# EAGLE design RainGaugeDropinPhoton (EAGLE 9.0.1)
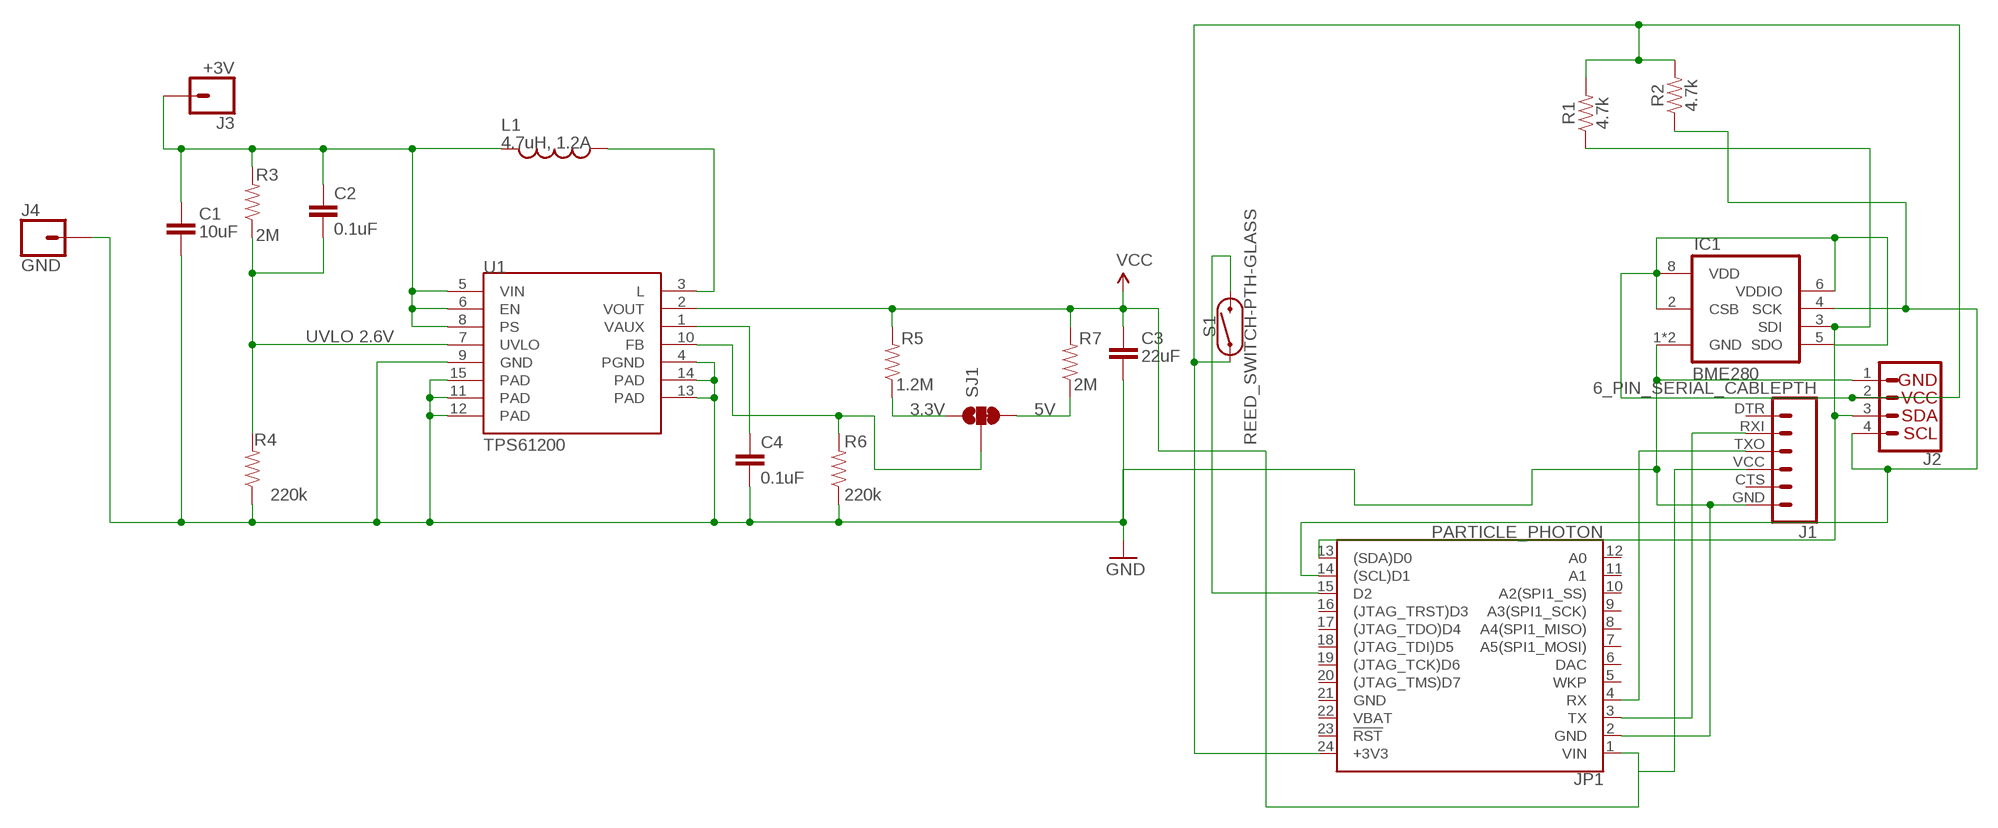
[diagram p0: schematic, sheet 1]

## Parts
C1  10uF  CAP1206  [1206]
C2  0.1uF  CAP0603-CAP  [0603-CAP]
C3  22uF  CAP0805  [0805]
C4  0.1uF  CAP0603-CAP  [0603-CAP]
IC1  BME280  [BME280]
J1  6_PIN_SERIAL_CABLEPTH  [FTDI_BASIC]
J2  QWIIC_CONNECTORJS-1MM  [1X04_1MM_RA]
J3  +3V  CONN_01OFFSET  [1X01_OFFSET]
J4  GND  CONN_01OFFSET  [1X01_OFFSET]
JP1  PARTICLE_PHOTON  [PARTICLE_PHOTON]
L1  4.7uH, 1.2A  INDUCTOR.  [CDRH2D09]
R1  4.7k  4.7KOHM-0603-1/10W-1%  [0603]
R2  4.7k  4.7KOHM-0603-1/10W-1%  [0603]
R3  2M  RESISTOR0603-RES  [0603-RES]
R4  220k  RESISTOR0603-RES  [0603-RES]
R5  1.2M  RESISTOR0603-RES  [0603-RES]
R6  220k  RESISTOR0603-RES  [0603-RES]
R7  2M  RESISTOR0603-RES  [0603-RES]
S1  REED_SWITCH-PTH-GLASS  [REED_SWITCH_GLASS]
SJ1  SOLDERJUMPER_2WAYPASTE2&3  [SJ_3_PASTE2&3]
U1  TPS61200  [QFN-10_PAD]

## Nets
3.3V: R5.1 SJ1.1
5V: R7.1 SJ1.3
FB: R6.2 SJ1.2 U1.10(FB)
GND: C1.2 C3.2 C4.2 IC1.1(GND) IC1.7(GND) J1.GND J2.1(GND) J4.1 JP1.2(GND) R4.1 R6.1 U1.4(PGND) U1.9(GND) U1.11(PAD) U1.12(PAD) U1.13(PAD) U1.14(PAD) U1.15(PAD)
N$1: J1.TXO JP1.4(RX)
N$3: IC1.4(SCK) J2.4(SCL) JP1.14((SCL)D1) R2.1
N$4: L1.P$1 U1.3(L)
N$5: IC1.3(SDI) J2.3(SDA) JP1.13((SDA)D0) R1.1
N$7: JP1.15(D2) S1.P$2
N$8: C4.1 U1.1(VAUX)
N$10: IC1.2(CSB) IC1.5(SDO) IC1.6(VDDIO) IC1.8(VDD) J2.2(VCC) JP1.24(+3V3) R1.2 R2.2 S1.P$1
N$11: J1.RXI JP1.3(TX)
UVLO: C2.2 R3.1 R4.2 U1.7(UVLO)
VCC: C3.1 J1.VCC JP1.1(VIN) R5.2 R7.2 U1.2(VOUT)
VIN: C1.1 C2.1 J3.1 L1.P$2 R3.2 U1.5(VIN) U1.6(EN) U1.8(PS)
Unconnected: J1.CTS J1.DTR JP1.5(WKP) JP1.6(DAC) JP1.7(A5(SPI1_MOSI)) JP1.8(A4(SPI1_MISO)) JP1.9(A3(SPI1_SCK)) JP1.10(A2(SPI1_SS)) JP1.11(A1) JP1.12(A0) JP1.16((JTAG_TRST)D3) JP1.17((JTAG_TDO)D4) JP1.18((JTAG_TDI)D5) JP1.19((JTAG_TCK)D6) JP1.20((JTAG_TMS)D7) JP1.23(!RST!)

## Notes on the sheet
- UVLO 2.6V

## Power pins joined to a net without a drawn wire
GND: JP1.21(GND)
VBAT: JP1.22(VBAT)

## Library data of the parts
C1 C3 = CH_passive:CAP: Capacitor Standard 0603 ceramic capacitor, and 0.1" leaded capacitor.
C2 C4 = SparkFun:CAP: Capacitor Standard 0603 ceramic capacitor, and 0.1" leaded capacitor.
IC1 = bosch-bme280:BME280: DIGITAL HUMIDITY, PRESSURE AND TEMPERATURE SENSOR * Digital interface I²C (up to 3.4 MHz) and SPI (3 and 4 wire, up to 10 MHz)* Supply voltage VDD main supply voltage range: 1.71 V to 3.6 V*VDDIO interface voltage range: 1.2 V to 3.6 V Operating range -40…+85 °C, 0…100 % rel. humidity, 300…1100 hPa The library has been designed by Richard Magdycz <https://www.facebook.com/groups/eaglecadsoftUK>
J1 = SparkFun-Connectors:6_PIN_SERIAL_CABLE: 6-pin header connection for use with the "FTDI BASIC" pinout - CABLE SIDE. Also known as "Arduino Serial Program Header". This is used on a design to provide a 6-pin connection point for serial communication usually from a USB cable (D+/D-) to these headers (RX/TX). It also has the remaining pins necessary for programming in the Arduino evironment (DTR, GND, and sometimes VCC). Note, this device has "CABLE" in the name. It is intended to be used on a design that usually lives on the end of your USB cable and prvides the converter chip (FTDI232 or FTDI231x) to commnicate serial RX/TX. The "sister" device, named "TARGET" is inteneded to be used on a design that contains a target micro-controller that you wish to program. You can populate with some of these: Female Headers <https://www.sparkfun.com/products/115> (PRT-00115) For reference (or to suit your programming needs) check out these designs: SparkFun FTDI Basic Breakout - 5V <https://www.sparkfun.com/products/9716> (DEV-09716) SparkFun FTDI Basic Breakout - 3.3V <https://www.sparkfun.com/products/9873> (DEV-09873) SparkFun FTDI SmartBasic <https://www.sparkfun.com/products/12935> (DEV-12935) SparkFun Beefy 3 - FTDI Basic Breakout <https://www.sparkfun.com/products/13746> (DEV-13746)
J2 = SparkFun-Connectors:QWIIC_CONNECTOR: SparkFun I2C Standard Qwiic Connector An SMD 1mm pitch JST connector makes it easy and quick (get it? Qwiic?) to connect I2C devices to each other. The Qwiic system <http://www.sparkfun.com/qwiic> enables fast and solderless connection between popular platforms and various sensors and actuators. We carry 200mm <https://www.sparkfun.com/products/14204>, 100mm <https://www.sparkfun.com/products/14205>, 50mm <https://www.sparkfun.com/products/14206>, and breadboard friendly <https://www.sparkfun.com/products/14207> Qwiic cables. We also offer 10 pcs strips <https://www.sparkfun.com/products/14323> the SMD connectors.
J3 J4 = SparkFun-Connectors:CONN_01: Single connection point. Often used as Generic Header-pin footprint for 0.1 inch spaced/style header connections On any of the 0.1 inch spaced packages, you can populate with these: Break Away Headers - Straight <https://www.sparkfun.com/products/116> (PRT-00116) Break Away Male Headers - Right Angle <https://www.sparkfun.com/products/553> (PRT-00553) Female Headers <https://www.sparkfun.com/products/115> (PRT-00115) Break Away Headers - Machine Pin <https://www.sparkfun.com/products/117> (PRT-00117) Break Away Female Headers - Swiss Machine Pin <https://www.sparkfun.com/products/743> (PRT-00743) This device is also useful as a general connection point to wire up your design to another part of your project. Our various solder wires solder well into these plated through hole pads. Hook-Up Wire - Assortment (Stranded, 22 AWG) <https://www.sparkfun.com/products/11375> (PRT-11375) Hook-Up Wire - Assortment (Solid Core, 22 AWG) <https://www.sparkfun.com/products/11367> (PRT-11367) View the entire wire category on our website here <https://www.sparkfun.com/categories/141> Special notes: SMTSO-256-ET is a "flush mount" nut for a 4-40 screw. We mostly use this on specialty testbeds; it is a nice way to connect hardware to your PCB at an adjustable hieght. Also note, the SNAP packages are for using a snappable style connector. We sell a baggie of snaps and they are also used on two LilyPad designs: Snap Assortment - 30 pack (male and female) <https://www.sparkfun.com/products/11347> (DEV-11347) LilyPad Arduino SimpleSnap <https://www.sparkfun.com/products/10941> (DEV-10941) LilyPad SimpleSnap Protoboard <https://www.sparkfun.com/products/10940> (DEV-10940)
JP1 = SparkFun-Boards:PARTICLE_PHOTON: Particle Photon Footprint of the Particle Photon that is used as a basis for many Photon shields. SparkFun Products: Particle Photon <https://www.sparkfun.com/products/13764> SparkFun Photon ProtoShield <https://www.sparkfun.com/products/13598> SparkFun Photon micro OLED Shield <https://www.sparkfun.com/products/13628> SparkFun Photon IMU Shield <https://www.sparkfun.com/products/13629> SparkFun Photon Battery Shield <https://www.sparkfun.com/products/13626>
L1 = SparkFun:INDUCTOR: Inductors Basic Inductor/Choke - 0603 and 1206. Footprints are not proven and vary greatly between part numbers.
R1 R2 = SparkFun-Resistors:4.7KOHM: 4.7kΩ resistor A resistor is a passive two-terminal electrical component that implements electrical resistance as a circuit element. Resistors act to reduce current flow, and, at the same time, act to lower voltage levels within circuits. - Wikipedia; PROD_ID: RES-07857
R3-R7 = SparkFun:RESISTOR: Resistor Basic schematic elements and footprints for 0603, 1206, and PTH resistors.
S1 = SparkFun-Switches:REED_SWITCH: Reed Switch A reed switch is a magnetically-actuated switch. When the device is exposed to a magnetic field, the two ferrous materials inside the switch pull together and the switch closes. Variant Overview PTH-GLASS Reed Switch <https://www.sparkfun.com/products/8642> (COM-08642) - PTH reed switch w/ glass body (6.0 x 0.9 mm) PTH-INSULATED Reed Switch - Insulated <https://www.sparkfun.com/products/10601> (COM-10601) - PTH reed switch w/ insulated body (15.1 x 4.2 mm); PROD_ID: SWCH-09282; SF_SKU: COM-08642
SJ1 = SparkFun:SOLDERJUMPER_2WAY: Solder Jumper 2 way solder jumper
U1 = SparkFun:TPS61200: DC to DC Booster

## Board
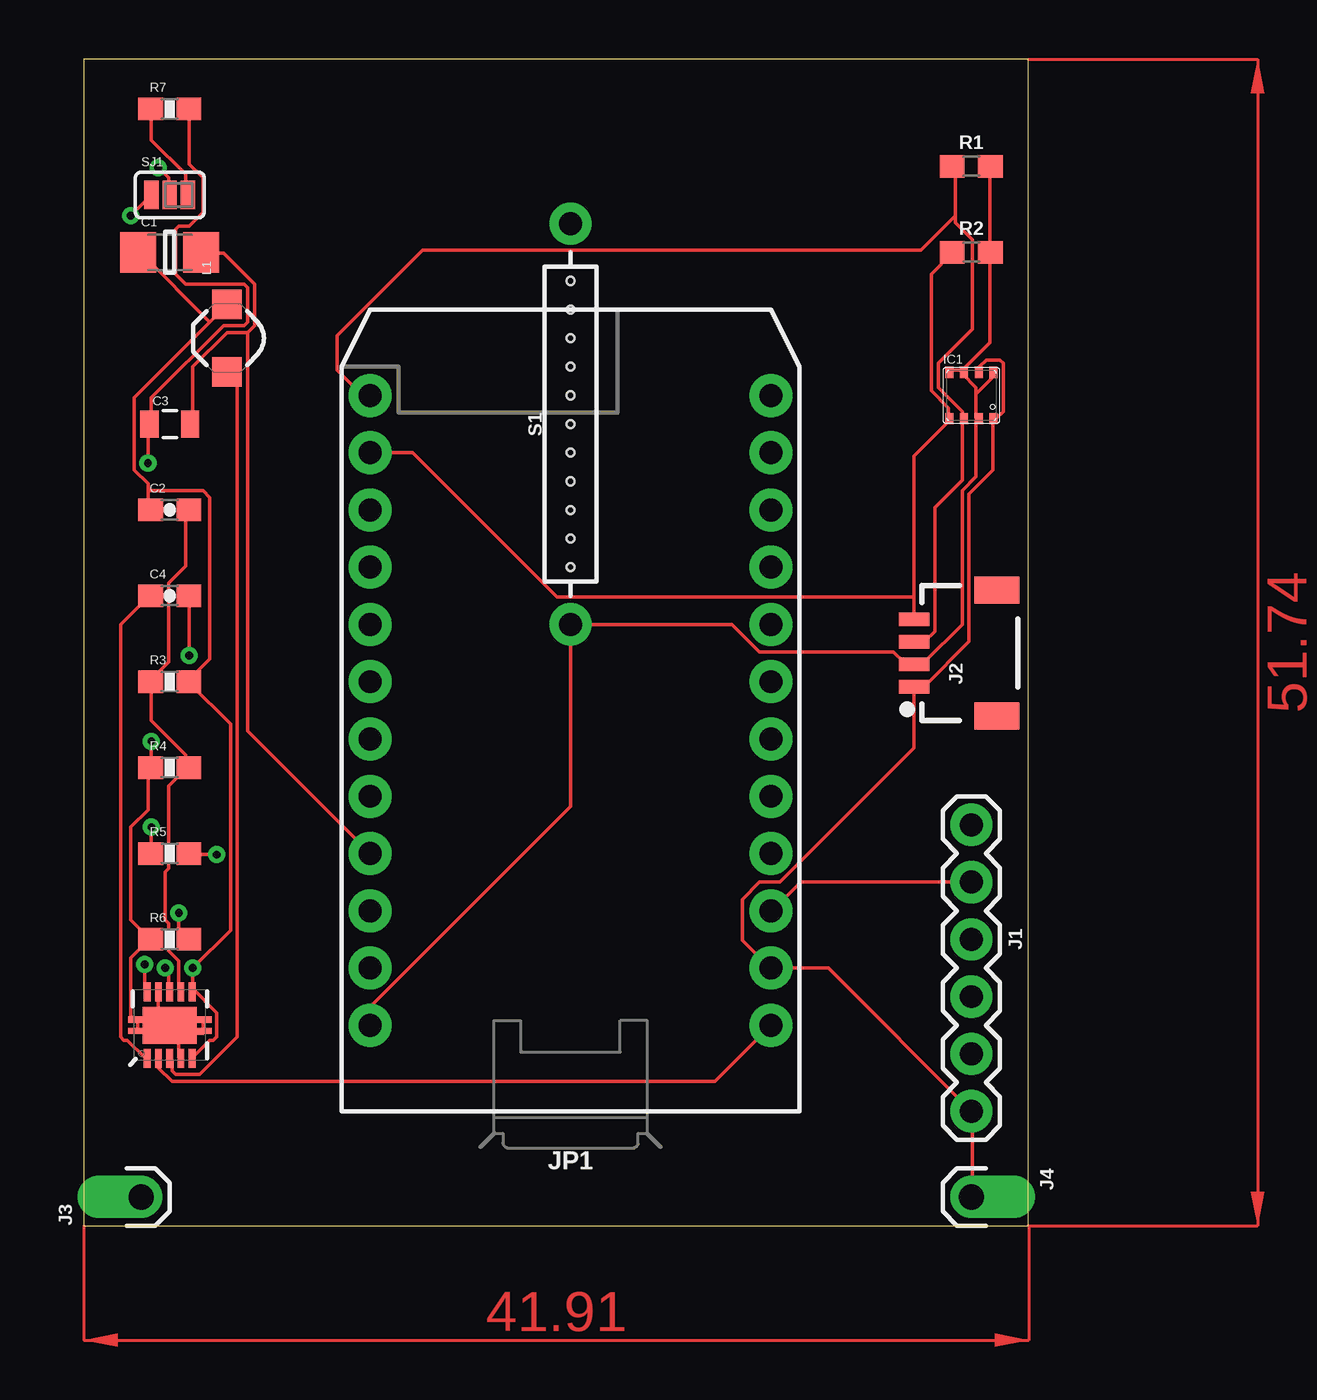
[diagram p1: board, top side]
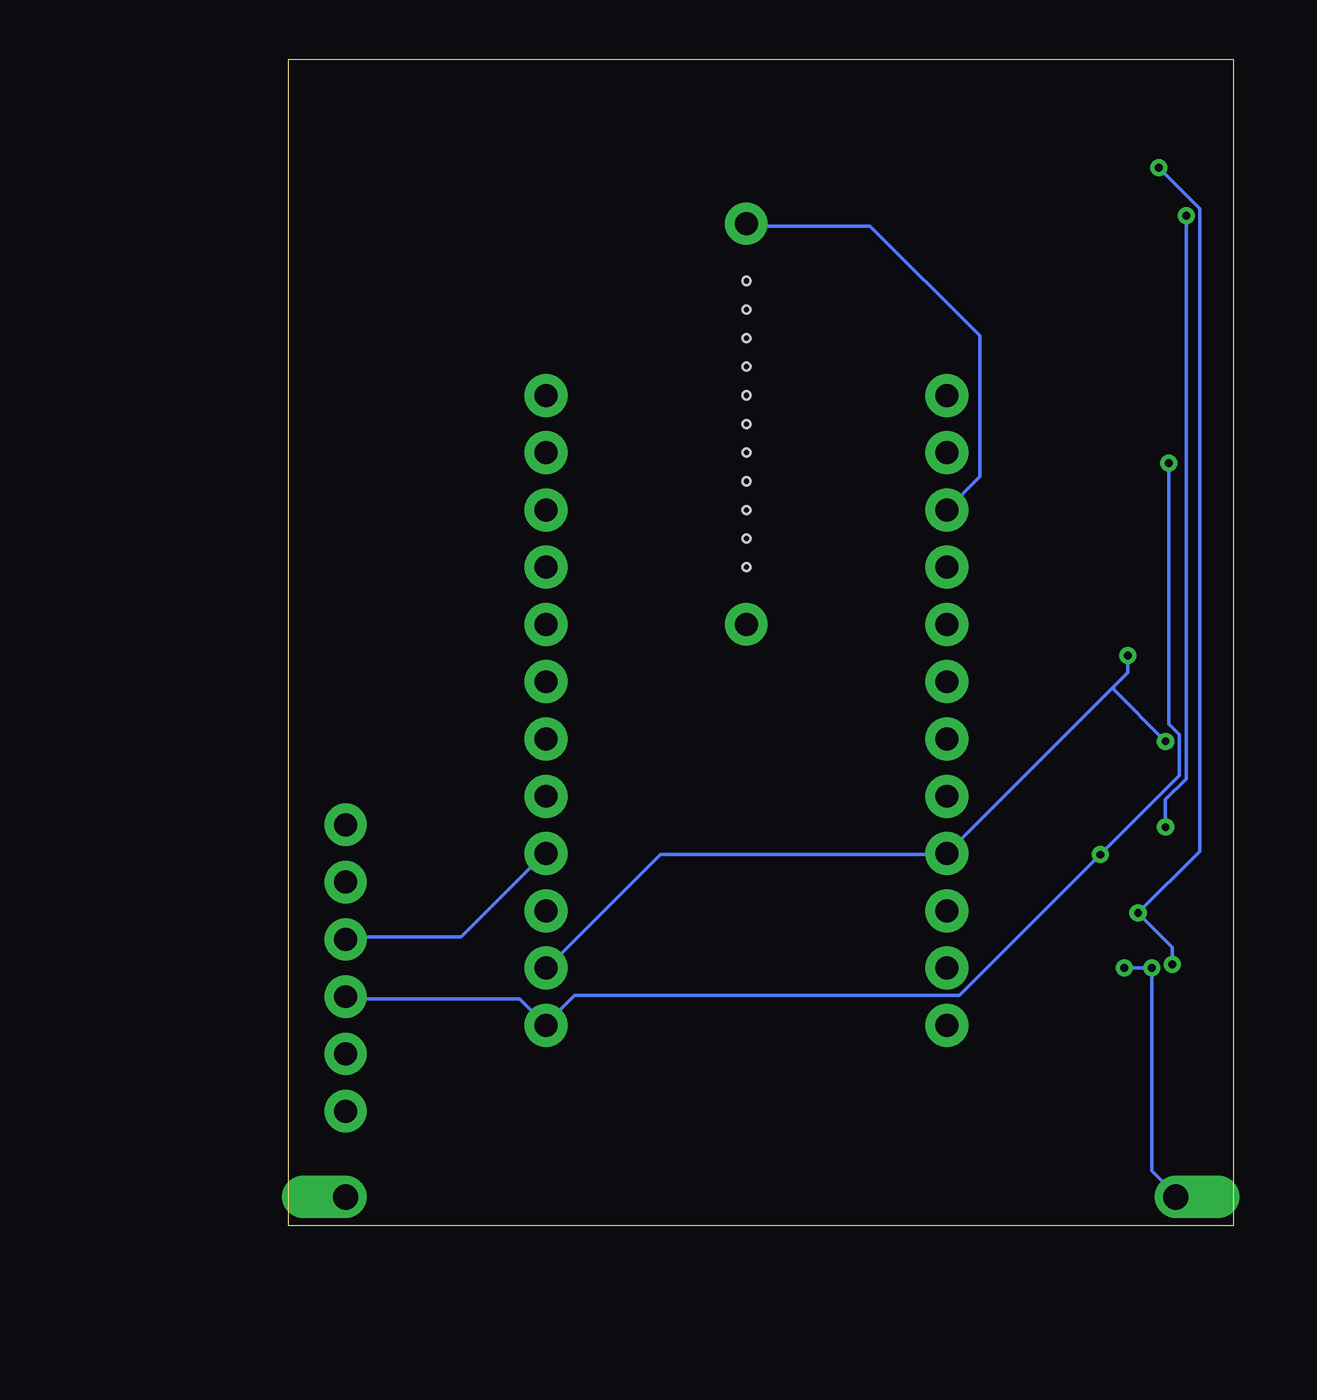
[diagram p2: board, bottom side, seen from below]

Size 41.89 x 51.74 mm. Coordinates in mm from the lower left corner, seen from the top.
Outline: 0,0 41.89,0 41.89,51.74 0,51.74 0,0
Copper layers (1*16): Top 0.035mm / dielectric 1.5mm / Bottom 0.035mm
Design rules "default": minimum track width 6mil, minimum drill 0.35mm, track to track 6mil, track to pad 6mil, pad to pad 6mil, via to via 6mil, smd to smd 6mil, copper to edge 40mil, drill to drill 6mil, minimum pad ring 10mil, minimum via ring 8mil, stop-mask expansion 4mil, vias tented up to drill 0mil, thermal gap 10mil
Holes 0.35 mm at 21.59,41.91 21.59,40.64 21.59,39.37 21.59,38.1 21.59,36.83 21.59,35.56 21.59,34.29 21.59,33.02 21.59,31.75 21.59,30.48 21.59,29.21
tKeepout: area 19.1,27.9 to 24.1,43.2

### Footprints (pad centres in the part's own frame; a part is rotated, then mirrored left to right if it is on the bottom)
1206 = smd 1.6 x 1.8: 1 -1.4,0; 2 1.4,0
0603-CAP = smd 1.1 x 1: 1 -0.85,0; 2 0.85,0
0805 = smd 0.8 x 1.2: 1 -0.9,0; 2 0.9,0
BME280 = smd 0.35 x 0.5: 1 0.975,-1.025; 2 0.325,-1.025; 3 -0.325,-1.025; 4 -0.975,-1.025; 5 -0.975,1.025; 6 -0.325,1.025; 7 0.325,1.025; 8 0.975,1.025
FTDI_BASIC = drill 1.016 pad 1.88: CTS 10.16,0; DTR 0,0; GND 12.7,0; RXI 2.54,0; TXO 5.08,0; VCC 7.62,0
1X04_1MM_RA = smd 0.6 x 1.35: 1 -1.5,0; 2 -0.5,0; 3 0.5,0; 4 1.5,0 | smd 1.2 x 2: NC1 2.8,-3.675; NC2 -2.8,-3.675
1X01_OFFSET = drill 1.118 pad 1.88 offset: 1 0,0
PARTICLE_PHOTON = drill 1.016 pad 1.905: 1 -8.89,13.97; 2 -8.89,11.43; 3 -8.89,8.89; 4 -8.89,6.35; 5 -8.89,3.81; 6 -8.89,1.27; 7 -8.89,-1.27; 8 -8.89,-3.81; 9 -8.89,-6.35; 10 -8.89,-8.89; 11 -8.89,-11.43; 12 -8.89,-13.97; 13 8.89,-13.97; 14 8.89,-11.43; 15 8.89,-8.89; 16 8.89,-6.35; 17 8.89,-3.81; 18 8.89,-1.27; 19 8.89,1.27; 20 8.89,3.81; 21 8.89,6.35; 22 8.89,8.89; 23 8.89,11.43; 24 8.89,13.97
CDRH2D09 = smd 1.3 x 1.3: P$1 -1.5,0; P$2 1.5,0
0603 = smd 1.1 x 1: 1 -0.85,0; 2 0.85,0
0603-RES = smd 1.1 x 1: 1 -0.85,0; 2 0.85,0
REED_SWITCH_GLASS = drill 1.016 pad 1.88: P$1 -8.89,0; P$2 8.89,0
SJ_3_PASTE2&3 = smd 0.635 x 1.27: 1 -0.813,0; 2 0,0; 3 0.813,0
QFN-10_PAD = smd 0.297 x 0.85: 1 -1,-1.475; 2 -0.5,-1.475; 3 0,-1.475; 4 0.5,-1.475; 5 1,-1.475; 6 1,1.475; 7 0.5,1.475; 8 0,1.475; 9 -0.5,1.475; 10 -1,1.475 | smd 0.7 x 0.28: 11 -1.5,0.25; 12 -1.5,-0.25; 13 1.5,0.25; 14 1.5,-0.25 | smd 2.4 x 1.65: 15 0,0

### Placement (x,y rotation side)
C1  3.81,43.18 0 top
C2  3.81,31.75 0 top
C3  3.81,35.56 0 top
C4  3.81,27.94 0 top
IC1  39.37,36.83 0 top
J1  39.37,17.78 270 top
J2  36.83,25.4 90 top
J3  2.54,1.27 90 top
J4  39.37,1.27 270 top
JP1  21.59,22.86 180 top
L1  6.35,39.37 90 top
R1  39.37,46.99 0 top
R2  39.37,43.18 0 top
R3  3.81,24.13 0 top
R4  3.81,20.32 0 top
R5  3.81,16.51 0 top
R6  3.81,12.7 0 top
R7  3.81,49.53 0 top
S1  21.59,35.56 90 top
SJ1  3.81,45.72 0 top
U1  3.81,8.89 0 top

### Tracks (layer width: path | path; a pad name or v marks a point on that pad's centre or on a via)
3.3V  (via drill 0.35)
  Top 0.152: v3,17.68 3,16.61 R5.1 | SJ1.1 v2.08,44.81
  Bottom 0.152: v3,17.68 3,18.9 2.08,19.81 v2.08,44.81
5V
  Top 0.152: R7.1 3,49.53 3,48.16 4.52,46.63 4.52,45.72 SJ1.3
FB  (via drill 0.35)
  Top 0.152: v2.69,11.58 2.69,10.52 U1.10 | v4.22,13.87 4.22,13.11 4.52,12.8 R6.2 | v3.3,46.94 3.76,46.48 3.76,45.72 SJ1.2
  Bottom 0.152: v2.69,11.58 2.69,12.34 v4.22,13.87 1.47,16.61 1.47,45.11 v3.3,46.94
GND  (via drill 0.35)
  Top 0.152: U1.13 5.28,9.14 5.28,8.69 U1.14 5.28,8.53 4.22,8.53 | 2.39,9.14 2.39,8.69 U1.12 | 4.22,8.53 4.22,7.47 U1.4 | 4.22,8.53 3.91,8.84 U1.15 | 3.3,9.45 U1.9 | 3.3,9.45 3.76,8.99 U1.15 | 2.39,9.14 3,9.14 3.3,9.45 | 2.39,9.14 U1.11 2.23,9.14 2.08,9.3 2.08,11.89 2.85,12.65 R6.1 2.85,12.8 2.08,13.56 2.08,17.68 2.85,18.44 2.85,20.27 R4.1 3,20.42 v3,21.49 | 3.3,9.45 U1.15 | 4.22,8.53 U1.15 | 7.26,39.62 6.35,39.62 4.83,38.1 4.83,35.66 C3.2 | 7.26,39.62 7.57,39.93 7.57,41.76 6.2,43.13 5.28,43.13 C1.2 | v4.67,25.3 4.67,27.89 C4.2 | 7.26,39.62 7.26,21.95 JP1.21 | IC1.7 39.73,37.95 39.73,38.1 40.03,38.41 40.64,38.41 40.79,38.25 40.79,36.12 40.49,35.81 IC1.1 40.33,35.66 40.33,33.53 39.27,32.46 39.27,25.91 37.29,23.93 36.83,23.93 J2.1 36.83,21.18 30.89,15.24 29.97,15.24 29.21,14.48 29.21,12.65 30.43,11.43 JP1.2 33.02,11.43 J1.GND 39.42,5.03 39.42,1.37 J4.1
  Bottom 0.152: v4.67,25.3 4.67,24.54 5.28,23.93 | 5.28,23.93 JP1.21 12.75,16.46 25.4,16.46 30.43,11.43 JP1.2 | v3,21.49 5.28,23.77 5.28,23.93
N$1
  Bottom 0.152: J1.TXO 39.27,12.8 34.24,12.8 30.58,16.46 JP1.4
N$3
  Top 0.152: R2.1 38.51,43.13 37.59,42.22 37.59,37.03 38.35,36.27 38.35,35.81 IC1.4 38.35,35.66 36.83,34.14 36.83,27.89 | 36.83,27.89 J2.4 | JP1.14 14.58,34.29 20.98,27.89 36.83,27.89
N$4
  Top 0.152: U1.3 3.91,7.32 3.91,6.86 4.06,6.71 5.13,6.71 6.81,8.38 6.81,37.34 6.35,37.8 L1.P$1
N$5
  Top 0.152: J2.3 37.29,25.91 37.74,26.36 37.74,31.85 38.96,33.07 38.96,35.66 IC1.3 38.96,35.81 38.96,36.12 37.9,37.19 37.9,38.25 39.42,39.78 39.42,43.74 38.66,44.5 38.66,44.81 | 38.66,44.81 38.66,46.94 R1.1 | 38.66,44.81 37.13,43.28 15.04,43.28 11.23,39.47 11.23,37.95 12.29,36.88 12.6,36.88 JP1.13
N$7
  Bottom 0.152: JP1.15 11.23,33.22 11.23,39.47 16.1,44.35 21.59,44.35 S1.P$2
N$8
  Top 0.152: U1.1 2.69,7.47 1.93,8.23 1.78,8.23 1.63,8.38 1.63,26.67 2.85,27.89 C4.1
N$10
  Top 0.152: R1.2 40.18,46.94 40.18,43.28 R2.2 40.18,43.13 40.18,39.17 38.96,37.95 | 38.96,37.95 38.51,37.95 IC1.5 | 39.57,36.88 39.57,37.19 38.96,37.8 IC1.6 38.96,37.95 | 39.57,36.88 39.57,35.81 IC1.2 39.57,35.66 39.57,33.22 38.96,32.61 38.96,26.67 37.29,24.99 36.83,24.99 | 39.57,36.88 40.33,37.64 40.33,37.8 IC1.8 | 36.83,24.99 36.37,24.99 35.92,25.45 29.97,25.45 28.75,26.67 S1.P$1 21.59,18.59 12.75,9.75 12.75,8.99 JP1.24 | 36.83,24.99 J2.2
N$11
  Top 0.152: J1.RXI 31.8,15.24 30.58,14.02 JP1.3
UVLO
  Top 0.152: U1.7 4.22,10.52 4.22,11.73 3.76,12.19 3.76,13.41 3.61,13.56 3.61,15.7 3.76,15.85 3.76,19.51 4.52,20.27 R4.2 4.52,20.42 4.52,20.88 3,22.4 3,24.08 R3.1 3,24.23 3.76,24.99 3.76,28.5 4.52,29.26 4.52,31.7 C2.2
VCC  (via drill 0.35)
  Top 0.152: R7.2 4.67,49.53 4.67,47.09 5.28,46.48 5.28,44.96 4.67,44.35 4.22,44.35 4.06,44.2 4.06,42.22 4.52,41.76 7.11,41.76 7.26,41.6 7.26,40.08 7.11,39.93 6.2,39.93 3,36.73 3,35.66 C3.1 2.85,35.51 v2.85,33.83 | JP1.1 27.99,6.4 3.91,6.4 3.3,7.01 3.3,7.32 U1.2 | v5.89,16.46 4.67,16.46 R5.2
  Bottom 0.152: J1.VCC 39.27,10.06 31.65,10.06 JP1.1 30.43,8.99 29.21,10.21 12.14,10.21 v5.89,16.46 2.39,19.96 2.39,21.79 2.85,22.25 v2.85,33.83
VIN  (via drill 0.35)
  Top 0.152: v3.61,11.43 3.76,11.28 3.76,10.52 U1.8 | 4.83,10.52 5.89,9.45 5.89,8.38 5.74,8.23 5.59,8.23 4.83,7.47 U1.5 | 2.85,32.61 2.85,32.92 2.23,33.53 2.23,36.73 5.59,40.08 | 2.85,32.61 2.85,31.85 C2.1 | 5.59,40.08 6.35,40.84 L1.P$2 | 2.85,32.61 5.28,32.61 5.59,32.31 5.59,25.15 4.67,24.23 R3.2 4.67,24.08 6.5,22.25 6.5,13.11 v4.83,11.43 4.83,10.52 | 5.59,40.08 2.54,43.13 C1.1 | 4.83,10.52 U1.6
  Bottom 0.152: J3.1 2.54,1.37 3.61,2.44 v3.61,11.43 v4.83,11.43
(copper drawn outside any net)
  shapes: Top area x2